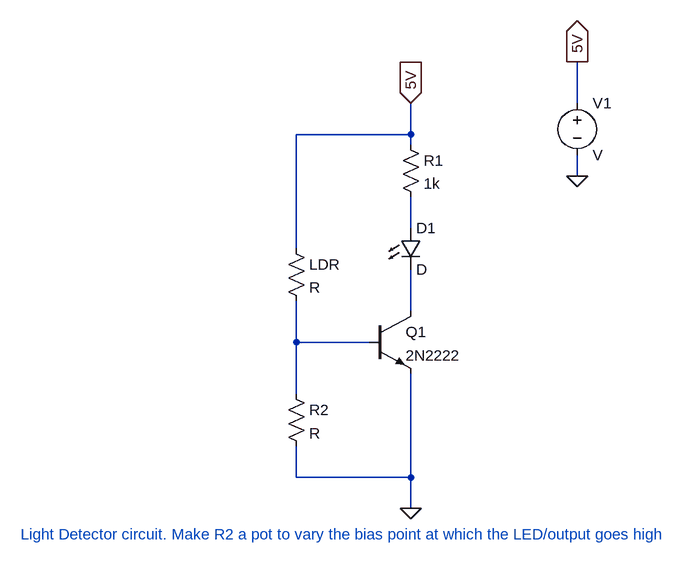
[diagram p0: schematic Light_detector_circuit.asc]
Light_detector_circuit.asc, the LTspice schematic file:
Version 4
SHEET 1 880 680
WIRE 496 -224 496 -288
WIRE 240 -176 240 -224
WIRE 240 -176 64 -176
WIRE 240 -160 240 -176
WIRE 496 -112 496 -144
WIRE 240 -32 240 -80
WIRE 64 0 64 -176
WIRE 240 96 240 32
WIRE 64 144 64 80
WIRE 176 144 64 144
WIRE 64 224 64 144
WIRE 64 352 64 304
WIRE 240 352 240 192
WIRE 240 352 64 352
WIRE 240 400 240 352
FLAG 240 400 0
FLAG 496 -112 0
FLAG 496 -288 5V
IOPIN 496 -288 Out
FLAG 240 -224 5V
IOPIN 240 -224 In
SYMBOL npn 176 96 R0
SYMATTR InstName Q1
SYMATTR Value 2N2222
SYMBOL LED 224 -32 R0
SYMATTR InstName D1
SYMBOL res 224 -176 R0
SYMATTR InstName R1
SYMATTR Value 1k
SYMBOL res 48 208 R0
SYMATTR InstName R2
SYMBOL res 48 -16 R0
SYMATTR InstName LDR
SYMBOL voltage 496 -240 R0
SYMATTR InstName V1
TEXT -360 440 Left 2 ;Light Detector circuit. Make R2 a pot to vary the bias point at which the LED/output goes high

The netlist it stands for:
* Light_detector_circuit.asc
Q1 N002 N003 0 0 2N2222
D1 N001 N002 D
R1 5V N001 1k
R2 N003 0 R
R§LDR 5V N003 R
V1 5V 0 V
.model D D
.lib standard.dio
.model NPN NPN
.model PNP PNP
.lib standard.bjt
* Light Detector circuit. Make R2 a pot to vary the bias point at which the LED/output goes high
.backanno
.end